# Altium schematic sheet PCMCIA.SchDoc
size 594 x 420 mm
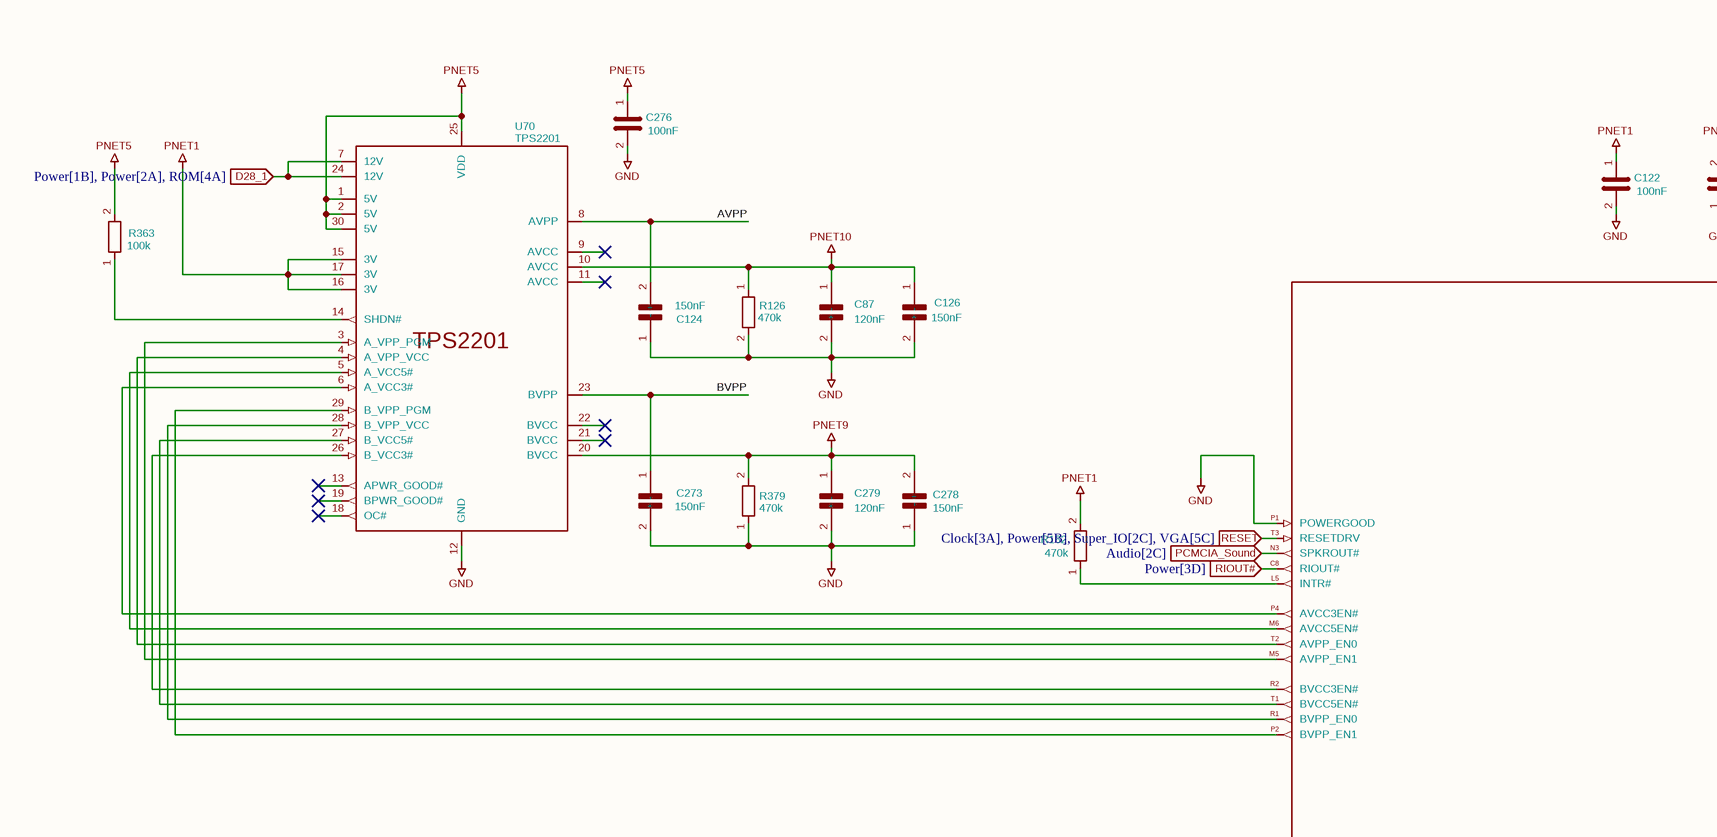
[diagram p0: PCMCIA.SchDoc, top left]
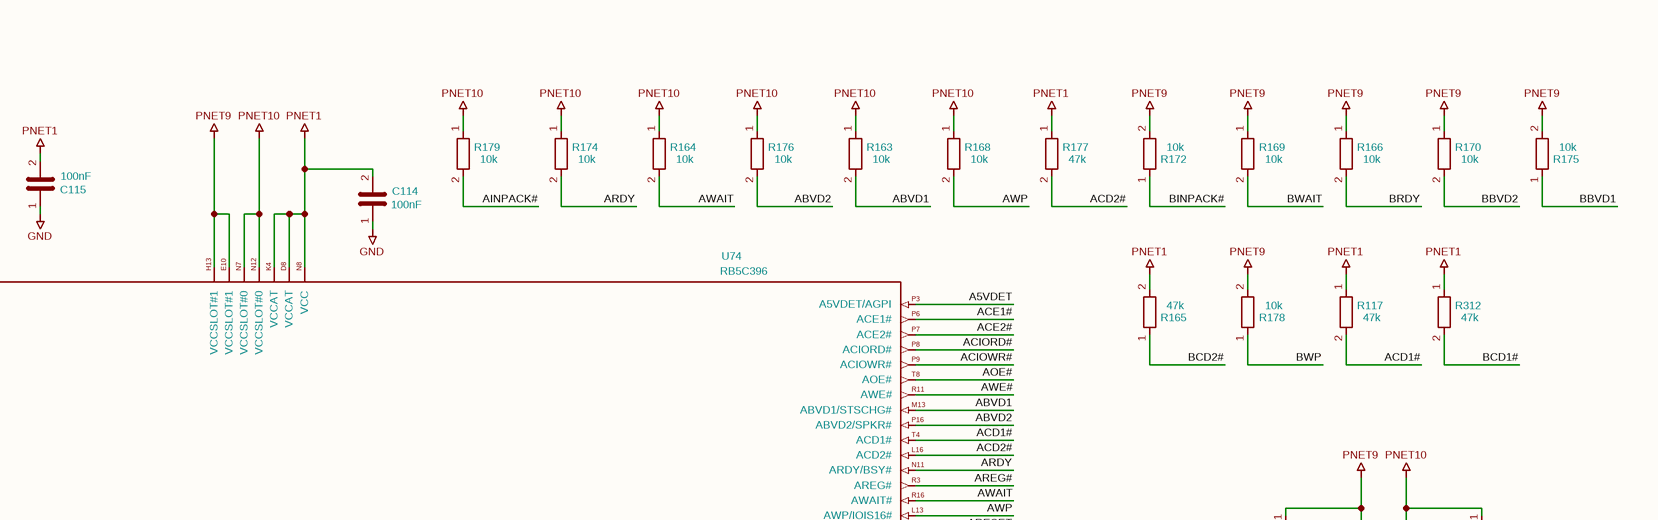
[diagram p1: PCMCIA.SchDoc, top right]
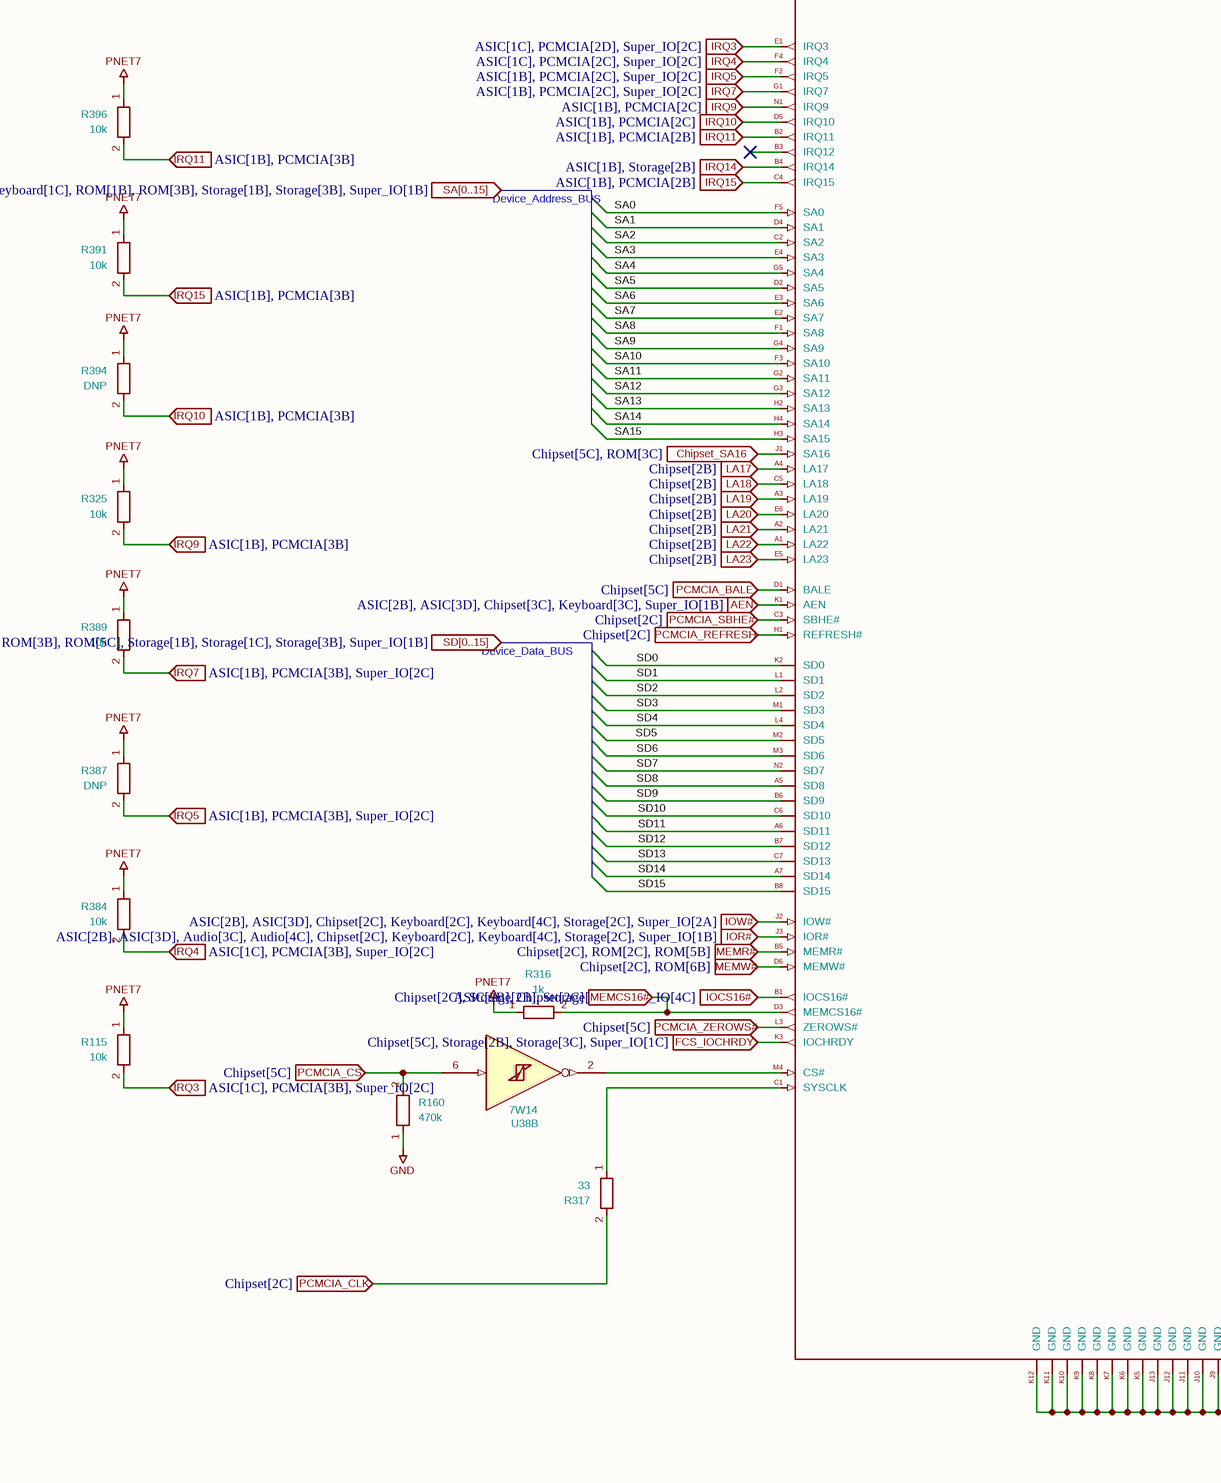
[diagram p2: PCMCIA.SchDoc, bottom left]
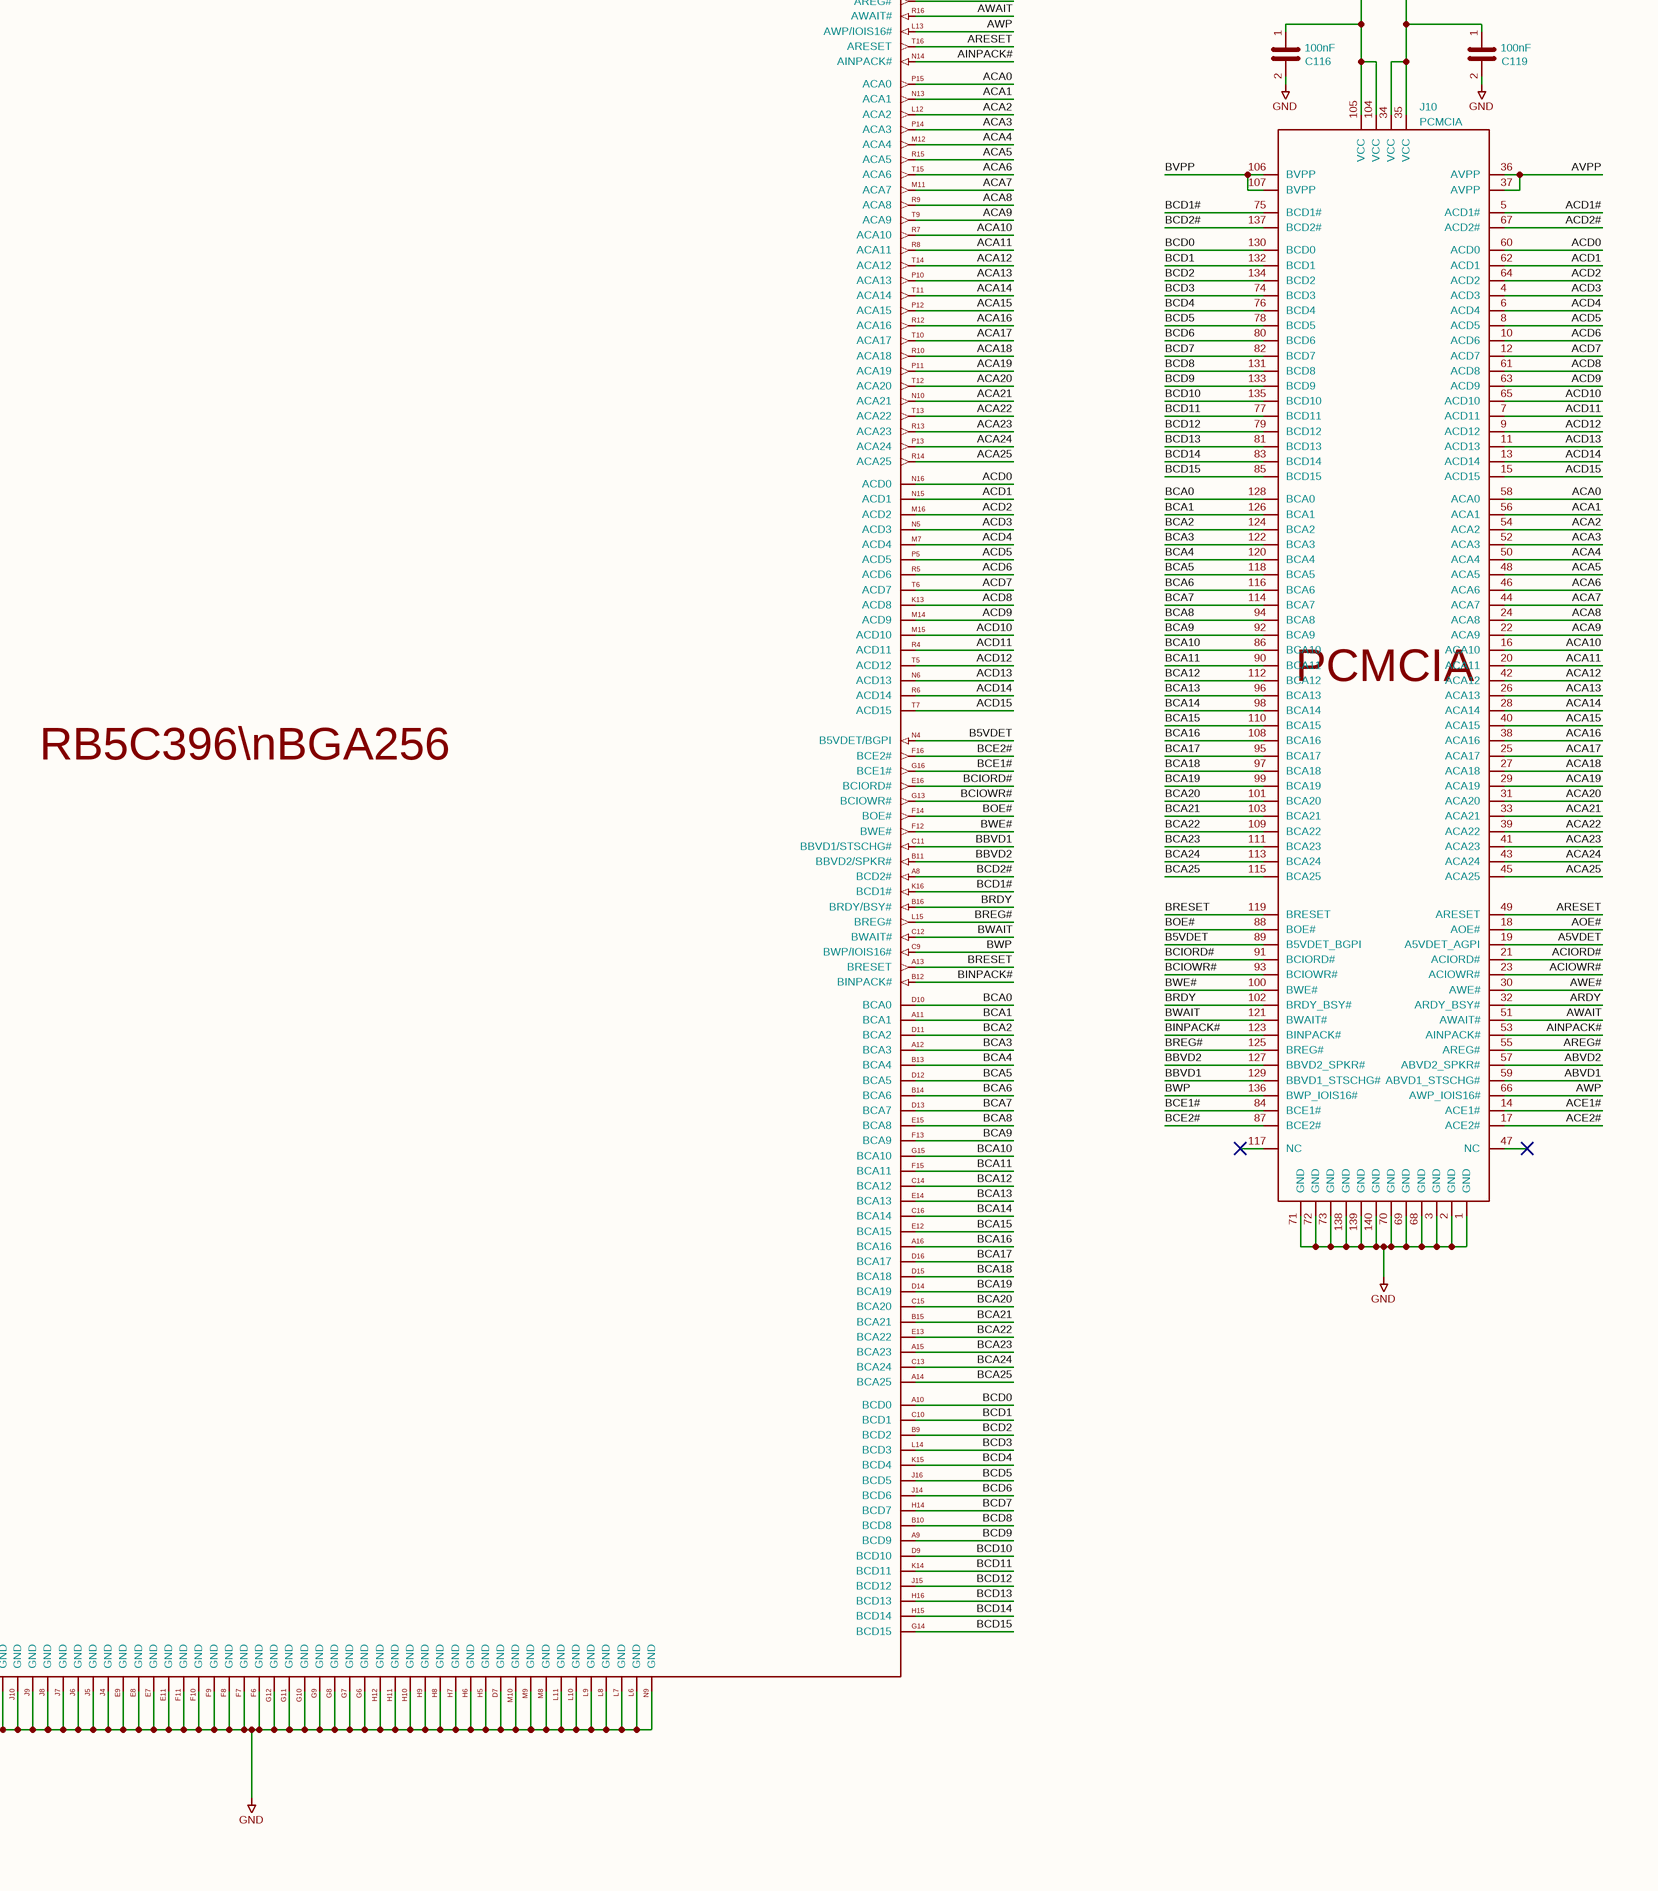
[diagram p3: PCMCIA.SchDoc, bottom right]

## Parts
C87  120nF  [C_0402_1005Metric]
C114  100nF  [C_0402_1005Metric]
C115  100nF  [C_0402_1005Metric]
C116  100nF  [C_0402_1005Metric]
C119  100nF  [C_0402_1005Metric]
C122  100nF  [C_0402_1005Metric]
C124  150nF  [C_0603_1608Metric]
C126  150nF  [C_0402_1005Metric]
C273  150nF  [C_0603_1608Metric]
C276  100nF  [C_0402_1005Metric]
C278  150nF  [C_0402_1005Metric]
C279  120nF  [C_0402_1005Metric]
J10  PCMCIA  [PCMCIA]
R115  10k  [R_0402_1005Metric]
R117  47k  [R_0402_1005Metric]
R126  470k  [R_0402_1005Metric]
R160  470k  [R_0402_1005Metric]
R162  470k  [R_0402_1005Metric]
R163  10k  [R_0402_1005Metric]
R164  10k  [R_0402_1005Metric]
R165  47k  [R_0402_1005Metric]
R166  10k  [R_0402_1005Metric]
R168  10k  [R_0402_1005Metric]
R169  10k  [R_0402_1005Metric]
R170  10k  [R_0402_1005Metric]
R172  10k  [R_0402_1005Metric]
R174  10k  [R_0402_1005Metric]
R175  10k  [R_0402_1005Metric]
R176  10k  [R_0402_1005Metric]
R177  47k  [R_0402_1005Metric]
R178  10k  [R_0402_1005Metric]
R179  10k  [R_0402_1005Metric]
R312  47k  [R_0402_1005Metric]
R316  1k  [R_0402_1005Metric]
R317  33  [R_0402_1005Metric]
R325  10k  [R_0402_1005Metric]
R363  100k  [R_0402_1005Metric]
R379  470k  [R_0402_1005Metric]
R384  10k  [R_0402_1005Metric]
R387  DNP  [R_0402_1005Metric]
R389  10k  [R_0402_1005Metric]
R391  10k  [R_0402_1005Metric]
R394  DNP  [R_0402_1005Metric]
R396  10k  [R_0402_1005Metric]
U38  7W14  [sso-8]  (part B of 4)
U70  TPS2201  [TSSOP-30_6.1x9.7mm_P0.65mm]
U74  RB5C396  [BGA-256]

## Ports
AEN (in, see ASIC[2B], ASIC[3D], Chipset[3C], Keyboard[3C], Super_IO[1B]), Chipset_SA16 (in, see Chipset[5C], ROM[3C]), D28_1 (in, see Power[1B], Power[2A], ROM[4A]), FCS_IOCHRDY (in, see Chipset[5C], Storage[2B], Storage[3C], Super_IO[1C]), IOCS16# (in, see Chipset[2C], Storage[2B], Storage[4B], Super_IO[4C]), IOR# (in, see ASIC[2B], ASIC[3D], Audio[3C], Audio[4C], Chipset[2C], Keyboard[2C], Keyboard[4C], Storage[2C], Super_IO[1B]), IOW# (in, see ASIC[2B], ASIC[3D], Chipset[2C], Keyboard[2C], Keyboard[4C], Storage[2C], Super_IO[2A]), IRQ3 (in, see ASIC[1C], PCMCIA[2D], Super_IO[2C]), IRQ3 (in, see ASIC[1C], PCMCIA[3B], Super_IO[2C]), IRQ4 (in, see ASIC[1C], PCMCIA[2C], Super_IO[2C]), IRQ4 (in, see ASIC[1C], PCMCIA[3B], Super_IO[2C]), IRQ5 (in, see ASIC[1B], PCMCIA[2C], Super_IO[2C]), IRQ5 (in, see ASIC[1B], PCMCIA[3B], Super_IO[2C]), IRQ7 (in, see ASIC[1B], PCMCIA[2C], Super_IO[2C]), IRQ7 (in, see ASIC[1B], PCMCIA[3B], Super_IO[2C]), IRQ9 (in, see ASIC[1B], PCMCIA[2C]), IRQ9 (in, see ASIC[1B], PCMCIA[3B]), IRQ10 (in, see ASIC[1B], PCMCIA[2C]), IRQ10 (in, see ASIC[1B], PCMCIA[3B]), IRQ11 (in, see ASIC[1B], PCMCIA[2B]), IRQ11 (in, see ASIC[1B], PCMCIA[3B]), IRQ14 (in, see ASIC[1B], Storage[2B]), IRQ15 (in, see ASIC[1B], PCMCIA[2B]), IRQ15 (in, see ASIC[1B], PCMCIA[3B]), LA17 (in, see Chipset[2B]), LA18 (in, see Chipset[2B]), LA19 (in, see Chipset[2B]), LA20 (in, see Chipset[2B]), LA21 (in, see Chipset[2B]), LA22 (in, see Chipset[2B]), LA23 (in, see Chipset[2B]), MEMCS16# (in, see ASIC[2B], Chipset[2C]), MEMR# (in, see Chipset[2C], ROM[2C], ROM[5B]), MEMW# (in, see Chipset[2C], ROM[6B]), PCMCIA_BALE (in, see Chipset[5C]), PCMCIA_CLK (in, see Chipset[2C]), PCMCIA_CS (in, see Chipset[5C]), PCMCIA_REFRESH (in, see Chipset[2C]), PCMCIA_SBHE# (in, see Chipset[2C]), PCMCIA_Sound (in, see Audio[2C]), PCMCIA_ZEROWS# (in, see Chipset[5C]), RESET (in, see Clock[3A], Power[5B], Super_IO[2C], VGA[5C]), RIOUT# (in, see Power[3D]), SA[0..15] (in, see ASIC[1B], ASIC[3D], Audio[4B], Chipset[2D], Chipset[6B], Keyboard[1C], ROM[1B], ROM[3B], Storage[1B], Storage[3B], Super_IO[1B]), SD[0..15] (in, see ASIC[1B], ASIC[3C], Audio[3B], Chipset[2B], Keyboard[1C], ROM[3B], ROM[5C], Storage[1B], Storage[1C], Storage[3B], Super_IO[1B])

## Nets
GND: C87.2(-) C114.1 C115.1 C116.2 C119.2 C122.2 C124.1(+) C126.2(-) C273.2(-) C276.2 C278.1(+) C279.2(-) J10.1(GND) J10.2(GND) J10.3(GND) J10.68(GND) J10.69(GND) J10.70(GND) J10.71(GND) J10.72(GND) J10.73(GND) J10.138(GND) J10.139(GND) J10.140(GND) R126.2 R160.1 R379.1 U70.12(GND) U74.D7(GND) U74.E7(GND) U74.E8(GND) U74.E9(GND) U74.E11(GND) U74.F6(GND) U74.F7(GND) U74.F8(GND) U74.F9(GND) U74.F10(GND) U74.F11(GND) U74.G6(GND) U74.G7(GND) U74.G8(GND) U74.G9(GND) U74.G10(GND) U74.G11(GND) U74.G12(GND) U74.H5(GND) U74.H6(GND) U74.H7(GND) U74.H8(GND) U74.H9(GND) U74.H10(GND) U74.H11(GND) U74.H12(GND) U74.J4(GND) U74.J5(GND) U74.J6(GND) U74.J7(GND) U74.J8(GND) U74.J9(GND) U74.J10(GND) U74.J11(GND) U74.J12(GND) U74.J13(GND) U74.K5(GND) U74.K6(GND) U74.K7(GND) U74.K8(GND) U74.K9(GND) U74.K10(GND) U74.K11(GND) U74.K12(GND) U74.L6(GND) U74.L7(GND) U74.L8(GND) U74.L9(GND) U74.L10(GND) U74.L11(GND) U74.M8(GND) U74.M9(GND) U74.M10(GND) U74.N9(GND) U74.P1(POWERGOOD)
PNET1: C114.2 C115.2 C122.1 R117.1 R162.2 R165.2 R177.1 R312.1 U70.15(3V) U70.16(3V) U70.17(3V) U74.D8(VCCAT) U74.K4(VCCAT) U74.N8(VCC)
PNET5: C276.1 R363.2 U70.1(5V) U70.2(5V) U70.25(VDD) U70.30(5V)
PNET7: R115.1 R316.1 R325.1 R384.1 R387.1 R389.1 R391.1 R394.1 R396.1
PNET9: C116.1 C278.2(-) C279.1(+) J10.104(VCC) J10.105(VCC) R166.1 R169.1 R170.1 R172.2 R175.2 R178.2 R379.2 U70.20(BVCC) U74.E10(VCCSLOT#1) U74.H13(VCCSLOT#1)
PNET10: C87.1(+) C119.1 C126.1(+) J10.34(VCC) J10.35(VCC) R126.1 R163.1 R164.1 R168.1 R174.1 R176.1 R179.1 U70.10(AVCC) U74.N7(VCCSLOT#0) U74.N12(VCCSLOT#0)
A5VDET: J10.19(A5VDET_AGPI) U74.P3(A5VDET/AGPI)
ABVD1: J10.59(ABVD1_STSCHG#) R163.2 U74.M13(ABVD1/STSCHG#)
ABVD2: J10.57(ABVD2_SPKR#) R176.2 U74.P16(ABVD2/SPKR#)
ACA0: J10.58(ACA0) U74.P15(ACA0)
ACA1: J10.56(ACA1) U74.N13(ACA1)
ACA2: J10.54(ACA2) U74.L12(ACA2)
ACA3: J10.52(ACA3) U74.P14(ACA3)
ACA4: J10.50(ACA4) U74.M12(ACA4)
ACA5: J10.48(ACA5) U74.R15(ACA5)
ACA6: J10.46(ACA6) U74.T15(ACA6)
ACA7: J10.44(ACA7) U74.M11(ACA7)
ACA8: J10.24(ACA8) U74.R9(ACA8)
ACA9: J10.22(ACA9) U74.T9(ACA9)
ACA10: J10.16(ACA10) U74.R7(ACA10)
ACA11: J10.20(ACA11) U74.R8(ACA11)
ACA12: J10.42(ACA12) U74.T14(ACA12)
ACA13: J10.26(ACA13) U74.P10(ACA13)
ACA14: J10.28(ACA14) U74.T11(ACA14)
ACA15: J10.40(ACA15) U74.P12(ACA15)
ACA16: J10.38(ACA16) U74.R12(ACA16)
ACA17: J10.25(ACA17) U74.T10(ACA17)
ACA18: J10.27(ACA18) U74.R10(ACA18)
ACA19: J10.29(ACA19) U74.P11(ACA19)
ACA20: J10.31(ACA20) U74.T12(ACA20)
ACA21: J10.33(ACA21) U74.N10(ACA21)
ACA22: J10.39(ACA22) U74.T13(ACA22)
ACA23: J10.41(ACA23) U74.R13(ACA23)
ACA24: J10.43(ACA24) U74.P13(ACA24)
ACA25: J10.45(ACA25) U74.R14(ACA25)
ACD0: J10.60(ACD0) U74.N16(ACD0)
ACD1: J10.62(ACD1) U74.N15(ACD1)
ACD1#: J10.5(ACD1#) R117.2 U74.T4(ACD1#)
ACD2: J10.64(ACD2) U74.M16(ACD2)
ACD2#: J10.67(ACD2#) R177.2 U74.L16(ACD2#)
ACD3: J10.4(ACD3) U74.N5(ACD3)
ACD4: J10.6(ACD4) U74.M7(ACD4)
ACD5: J10.8(ACD5) U74.P5(ACD5)
ACD6: J10.10(ACD6) U74.R5(ACD6)
ACD7: J10.12(ACD7) U74.T6(ACD7)
ACD8: J10.61(ACD8) U74.K13(ACD8)
ACD9: J10.63(ACD9) U74.M14(ACD9)
ACD10: J10.65(ACD10) U74.M15(ACD10)
ACD11: J10.7(ACD11) U74.R4(ACD11)
ACD12: J10.9(ACD12) U74.T5(ACD12)
ACD13: J10.11(ACD13) U74.N6(ACD13)
ACD14: J10.13(ACD14) U74.R6(ACD14)
ACD15: J10.15(ACD15) U74.T7(ACD15)
ACE1#: J10.14(ACE1#) U74.P6(ACE1#)
ACE2#: J10.17(ACE2#) U74.P7(ACE2#)
ACIORD#: J10.21(ACIORD#) U74.P8(ACIORD#)
ACIOWR#: J10.23(ACIOWR#) U74.P9(ACIOWR#)
AEN: U74.K1(AEN) ; port AEN
AINPACK#: J10.53(AINPACK#) R179.2 U74.N14(AINPACK#)
AOE#: J10.18(AOE#) U74.T8(AOE#)
ARDY: J10.32(ARDY_BSY#) R174.2 U74.N11(ARDY/BSY#)
AREG#: J10.55(AREG#) U74.R3(AREG#)
ARESET: J10.49(ARESET) U74.T16(ARESET)
AVPP: C124.2(-) J10.36(AVPP) J10.37(AVPP) U70.8(AVPP)
AWAIT: J10.51(AWAIT#) R164.2 U74.R16(AWAIT#)
AWE#: J10.30(AWE#) U74.R11(AWE#)
AWP: J10.66(AWP_IOIS16#) R168.2 U74.L13(AWP/IOIS16#)
B5VDET: J10.89(B5VDET_BGPI) U74.N4(B5VDET/BGPI)
BBVD1: J10.129(BBVD1_STSCHG#) R175.1 U74.C11(BBVD1/STSCHG#)
BBVD2: J10.127(BBVD2_SPKR#) R170.2 U74.B11(BBVD2/SPKR#)
BCA0: J10.128(BCA0) U74.D10(BCA0)
BCA1: J10.126(BCA1) U74.A11(BCA1)
BCA2: J10.124(BCA2) U74.D11(BCA2)
BCA3: J10.122(BCA3) U74.A12(BCA3)
BCA4: J10.120(BCA4) U74.B13(BCA4)
BCA5: J10.118(BCA5) U74.D12(BCA5)
BCA6: J10.116(BCA6) U74.B14(BCA6)
BCA7: J10.114(BCA7) U74.D13(BCA7)
BCA8: J10.94(BCA8) U74.E15(BCA8)
BCA9: J10.92(BCA9) U74.F13(BCA9)
BCA10: J10.86(BCA10) U74.G15(BCA10)
BCA11: J10.90(BCA11) U74.F15(BCA11)
BCA12: J10.112(BCA12) U74.C14(BCA12)
BCA13: J10.96(BCA13) U74.E14(BCA13)
BCA14: J10.98(BCA14) U74.C16(BCA14)
BCA15: J10.110(BCA15) U74.E12(BCA15)
BCA16: J10.108(BCA16) U74.A16(BCA16)
BCA17: J10.95(BCA17) U74.D16(BCA17)
BCA18: J10.97(BCA18) U74.D15(BCA18)
BCA19: J10.99(BCA19) U74.D14(BCA19)
BCA20: J10.101(BCA20) U74.C15(BCA20)
BCA21: J10.103(BCA21) U74.B15(BCA21)
BCA22: J10.109(BCA22) U74.E13(BCA22)
BCA23: J10.111(BCA23) U74.A15(BCA23)
BCA24: J10.113(BCA24) U74.C13(BCA24)
BCA25: J10.115(BCA25) U74.A14(BCA25)
BCD0: J10.130(BCD0) U74.A10(BCD0)
BCD1: J10.132(BCD1) U74.C10(BCD1)
BCD1#: J10.75(BCD1#) R312.2 U74.K16(BCD1#)
BCD2: J10.134(BCD2) U74.B9(BCD2)
BCD2#: J10.137(BCD2#) R165.1 U74.A8(BCD2#)
BCD3: J10.74(BCD3) U74.L14(BCD3)
BCD4: J10.76(BCD4) U74.K15(BCD4)
BCD5: J10.78(BCD5) U74.J16(BCD5)
BCD6: J10.80(BCD6) U74.J14(BCD6)
BCD7: J10.82(BCD7) U74.H14(BCD7)
BCD8: J10.131(BCD8) U74.B10(BCD8)
BCD9: J10.133(BCD9) U74.A9(BCD9)
BCD10: J10.135(BCD10) U74.D9(BCD10)
BCD11: J10.77(BCD11) U74.K14(BCD11)
BCD12: J10.79(BCD12) U74.J15(BCD12)
BCD13: J10.81(BCD13) U74.H16(BCD13)
BCD14: J10.83(BCD14) U74.H15(BCD14)
BCD15: J10.85(BCD15) U74.G14(BCD15)
BCE1#: J10.84(BCE1#) U74.G16(BCE1#)
BCE2#: J10.87(BCE2#) U74.F16(BCE2#)
BCIORD#: J10.91(BCIORD#) U74.E16(BCIORD#)
BCIOWR#: J10.93(BCIOWR#) U74.G13(BCIOWR#)
BINPACK#: J10.123(BINPACK#) R172.1 U74.B12(BINPACK#)
BOE#: J10.88(BOE#) U74.F14(BOE#)
BRDY: J10.102(BRDY_BSY#) R166.2 U74.B16(BRDY/BSY#)
BREG#: J10.125(BREG#) U74.L15(BREG#)
BRESET: J10.119(BRESET) U74.A13(BRESET)
BVPP: C273.1(+) J10.106(BVPP) J10.107(BVPP) U70.23(BVPP)
BWAIT: J10.121(BWAIT#) R169.2 U74.C12(BWAIT#)
BWE#: J10.100(BWE#) U74.F12(BWE#)
BWP: J10.136(BWP_IOIS16#) R178.1 U74.C9(BWP/IOIS16#)
Chipset_SA16: U74.J1(SA16) ; port Chipset_SA16
D28_1: U70.7(12V) U70.24(12V) ; port D28_1
FCS_IOCHRDY: U74.K3(IOCHRDY) ; port FCS_IOCHRDY
IOCS16#: U74.B1(IOCS16#) ; port IOCS16#
IOR#: U74.J3(IOR#) ; port IOR#
IOW#: U74.J2(IOW#) ; port IOW#
IRQ3: R115.2 U74.E1(IRQ3) ; port IRQ3
IRQ4: R384.2 U74.F4(IRQ4) ; port IRQ4
IRQ5: R387.2 U74.F2(IRQ5) ; port IRQ5
IRQ7: R389.2 U74.G1(IRQ7) ; port IRQ7
IRQ9: R325.2 U74.N1(IRQ9) ; port IRQ9
IRQ10: R394.2 U74.D5(IRQ10) ; port IRQ10
IRQ11: R396.2 U74.B2(IRQ11) ; port IRQ11
IRQ14: U74.B4(IRQ14) ; port IRQ14
IRQ15: R391.2 U74.C4(IRQ15) ; port IRQ15
LA17: U74.A4(LA17) ; port LA17
LA18: U74.C5(LA18) ; port LA18
LA19: U74.A3(LA19) ; port LA19
LA20: U74.E6(LA20) ; port LA20
LA21: U74.A2(LA21) ; port LA21
LA22: U74.A1(LA22) ; port LA22
LA23: U74.E5(LA23) ; port LA23
MEMCS16#: R316.2 U74.D3(MEMCS16#) ; port MEMCS16#
MEMR#: U74.B5(MEMR#) ; port MEMR#
MEMW#: U74.D6(MEMW#) ; port MEMW#
PCMCIA_BALE: U74.D1(BALE) ; port PCMCIA_BALE
PCMCIA_CLK: R317.2 ; port PCMCIA_CLK
PCMCIA_CS: R160.2 U38.6 ; port PCMCIA_CS
PCMCIA_REFRESH: U74.H1(REFRESH#) ; port PCMCIA_REFRESH
PCMCIA_SBHE#: U74.C3(SBHE#) ; port PCMCIA_SBHE#
PCMCIA_Sound: U74.N3(SPKROUT#) ; port PCMCIA_Sound
PCMCIA_ZEROWS#: U74.L3(ZEROWS#) ; port PCMCIA_ZEROWS#
RESET: U74.T3(RESETDRV) ; port RESET
RIOUT#: U74.C8(RIOUT#) ; port RIOUT#
SA0: U74.F5(SA0)
SA1: U74.D4(SA1)
SA2: U74.C2(SA2)
SA3: U74.E4(SA3)
SA4: U74.G5(SA4)
SA5: U74.D2(SA5)
SA6: U74.E3(SA6)
SA7: U74.E2(SA7)
SA8: U74.F1(SA8)
SA9: U74.G4(SA9)
SA10: U74.F3(SA10)
SA11: U74.G2(SA11)
SA12: U74.G3(SA12)
SA13: U74.H2(SA13)
SA14: U74.H4(SA14)
SA15: U74.H3(SA15)
SD0: U74.K2(SD0)
SD1: U74.L1(SD1)
SD2: U74.L2(SD2)
SD3: U74.M1(SD3)
SD4: U74.L4(SD4)
SD5: U74.M2(SD5)
SD6: U74.M3(SD6)
SD7: U74.N2(SD7)
SD8: U74.A5(SD8)
SD9: U74.B6(SD9)
SD10: U74.C6(SD10)
SD11: U74.A6(SD11)
SD12: U74.B7(SD12)
SD13: U74.C7(SD13)
SD14: U74.A7(SD14)
SD15: U74.B8(SD15)
NetR162_1: R162.1 U74.L5(INTR#)
NetR317_1: R317.1 U74.C1(SYSCLK)
NetR363_1: R363.1 U70.14(SHDN#)
NetU38_2: U38.2 U74.M4(CS#)
NetU70_3: U70.3(A_VPP_PGM) U74.M5(AVPP_EN1)
NetU70_4: U70.4(A_VPP_VCC) U74.T2(AVPP_EN0)
NetU70_5: U70.5(A_VCC5#) U74.M6(AVCC5EN#)
NetU70_6: U70.6(A_VCC3#) U74.P4(AVCC3EN#)
NetU70_26: U70.26(B_VCC3#) U74.R2(BVCC3EN#)
NetU70_27: U70.27(B_VCC5#) U74.T1(BVCC5EN#)
NetU70_28: U70.28(B_VPP_VCC) U74.R1(BVPP_EN0)
NetU70_29: U70.29(B_VPP_PGM) U74.P2(BVPP_EN1)

Not connected (* = marked no-connect by the designer): J10 47(NC)* 117(NC)*; U70 9(AVCC)* 11(AVCC)* 13(APWR_GOOD#)* 18(OC#)* 19(BPWR_GOOD#)* 21(BVCC)* 22(BVCC)*; U74 B3(IRQ12)*

## Notes on the sheet
- Device_Address_BUS
- Device_Data_BUS
- 1
- 2
- 3
- 4
- 5
- 6
- 7
- 8
- 9
- 10
- 11
- A
- B
- C
- D
- E
- F
- G
- H
- Title: PC110
- File: PCMCIA.kicad_sch
- Sheet: /
- Recreated by: Ahmad Byagowi
- KiCad E.D.A.  kicad (5.1.4)-1
- Size: A2
- Date:
- Rev:
- Id: 1/1
- (in symbol RB5C396) RB5C396\nBGA256

## Library data of the parts
C87 C114-C116 C119 C122 C124 C126 C273 C276 C278 C279 = C
  C87 C279: Value: 120nF; Footprint: Capacitor_SMD:C_0402_1005Metric
  C114-C116 C119 C122 C276: Value: 100nF; Footprint: Capacitor_SMD:C_0402_1005Metric
  C124 C273: Value: 150nF; Footprint: Capacitor_SMD:C_0603_1608Metric
  C126 C278: Value: 150nF; Footprint: Capacitor_SMD:C_0402_1005Metric
J10 = PCMCIA_Conn: Value: PCMCIA; Footprint: PC110:PCMCIA
R115 R117 R126 R160 R162-R166 R168-R170 R172 R174-R179 R312 R316 R317 R325 R363 R379 R384 R387 R389 R391 R394 R396 = R
  R115 R163 R164 R166 R168-R170 R172 R174-R176 R178 R179: Value: 10k; Footprint: PCM_Resistor_SMD_AKL:R_0402_1005Metric
  R117 R165 R177: Value: 47k; Footprint: PCM_Resistor_SMD_AKL:R_0402_1005Metric
  R126 R160 R162: Value: 470k; Footprint: PCM_Resistor_SMD_AKL:R_0402_1005Metric
  R312: Value: 47k; Footprint: Resistor_SMD:R_0402_1005Metric
  R316: Value: 1k; Footprint: PCM_Resistor_SMD_AKL:R_0402_1005Metric
  R317: Value: 33; Footprint: PCM_Resistor_SMD_AKL:R_0402_1005Metric
  R325 R384 R389 R391 R396: Value: 10k; Footprint: Resistor_SMD:R_0402_1005Metric
  R363: Value: 100k; Footprint: Resistor_SMD:R_0402_1005Metric
  R379: Value: 470k; Footprint: Resistor_SMD:R_0402_1005Metric
  R387 R394: Value: DNP; Footprint: Resistor_SMD:R_0402_1005Metric
U38 = 74LVC3G14: Value: 7W14; Footprint: PC110:sso-8
U70 = TPS2201: Value: TPS2201; Footprint: Package_SO:TSSOP-30_6.1x9.7mm_P0.65mm
U74 = RB5C396: Value: RB5C396; Footprint: PC110:BGA-256